# EAGLE design AC2 (EAGLE 6.4)

## Sheet 1 of 2
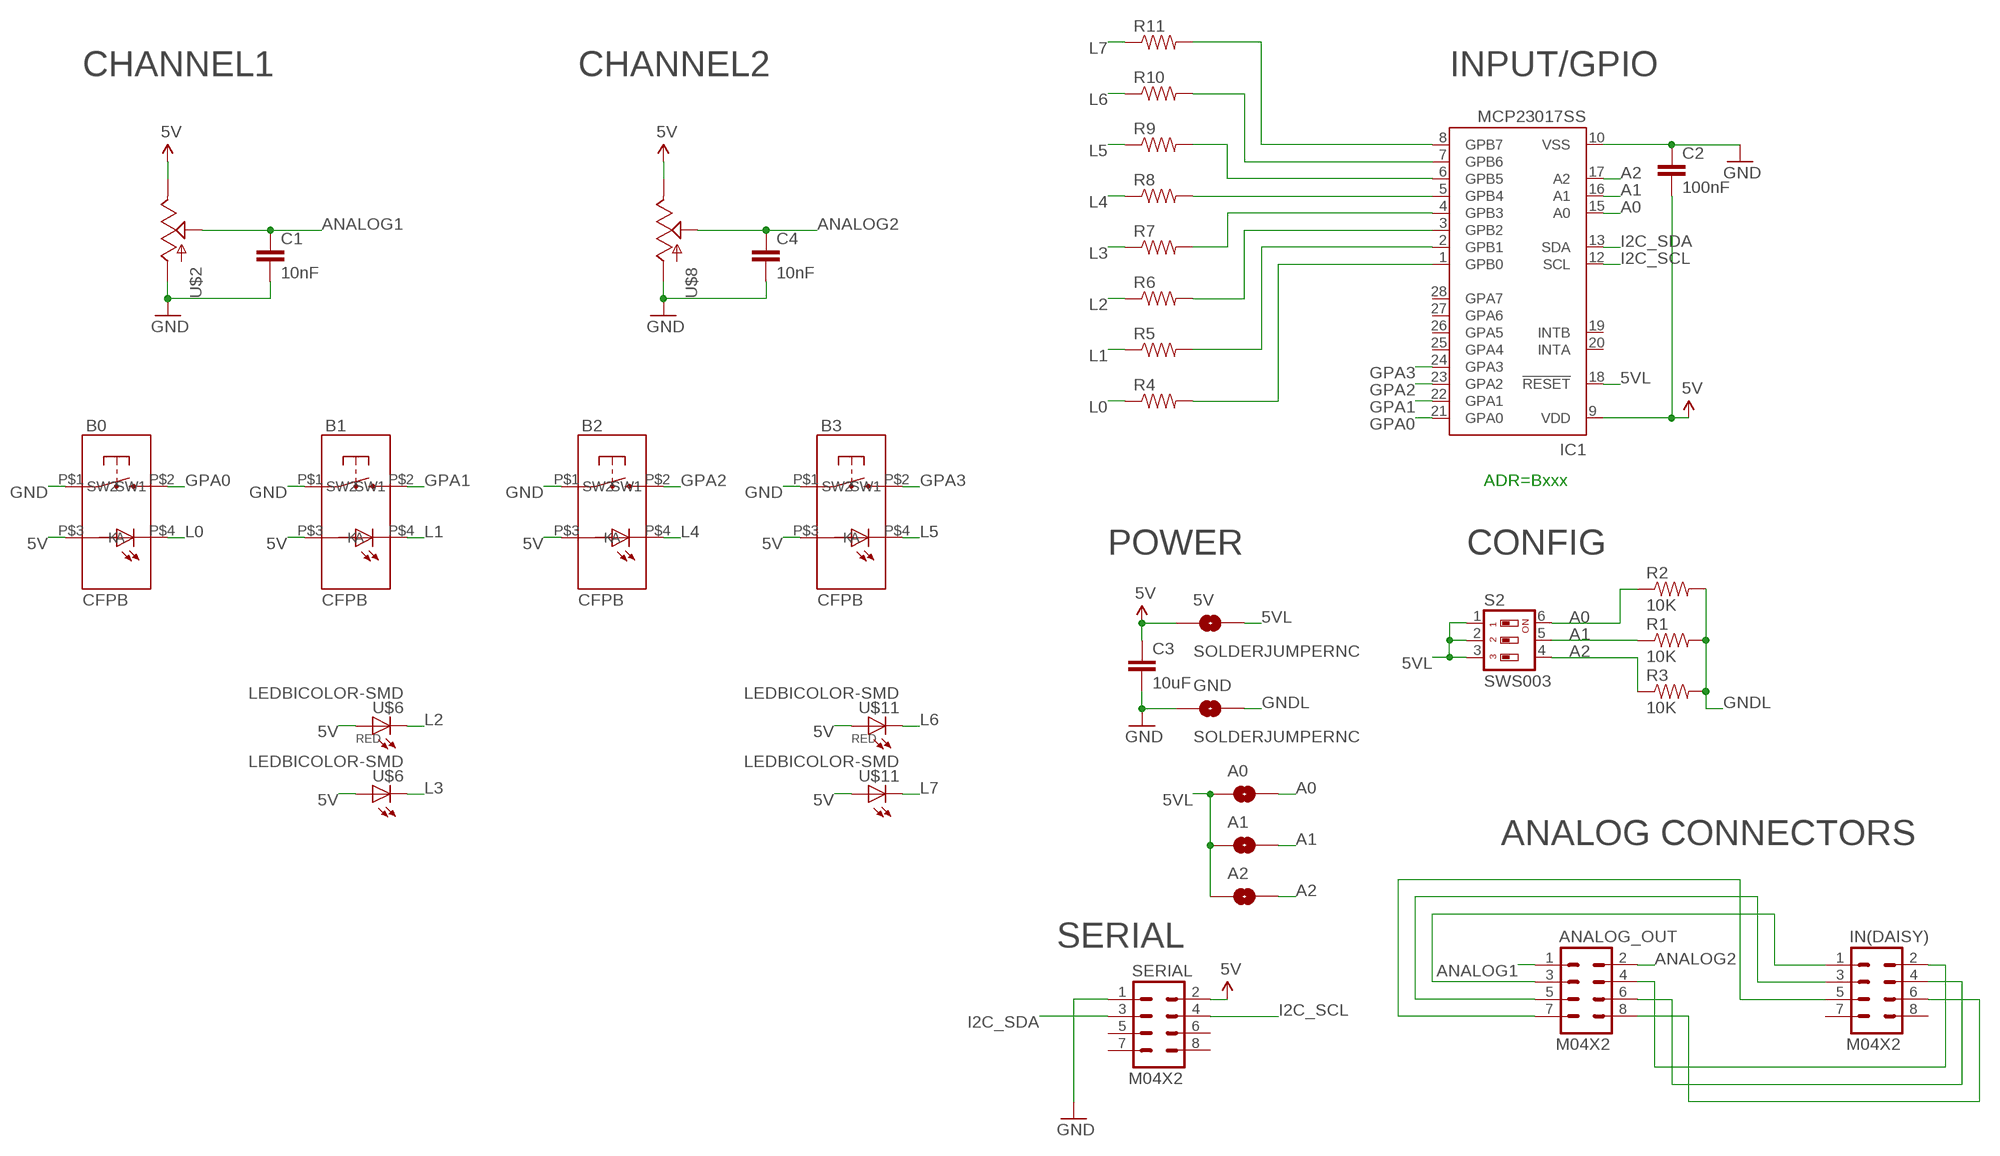
[diagram p0: schematic, sheet 1]

### Parts
5V  SOLDERJUMPERNC  [SJ_2S]
A0  SOLDERJUMPERNC  [SJ_2S]
A1  SOLDERJUMPERNC  [SJ_2S]
A2  SOLDERJUMPERNC  [SJ_2S]
ANALOG_OUT  M04X2  [2X4]
B0  CFPB  [CFPB-6/9MM]
B1  CFPB  [CFPB-6/9MM]
B2  CFPB  [CFPB-6/9MM]
B3  CFPB  [CFPB-6/9MM]
C1  10nF  CAP0603-CAP  [0603-CAP]
C2  100nF  CAP0603-CAP  [0603-CAP]
C3  10uF  CAP0805  [0805]
C4  10nF  CAP0603-CAP  [0603-CAP]
GND  SOLDERJUMPERNC  [SJ_2S]
IC1  MCP23017SS  [SSOP28]
IN(DAISY)  M04X2  [2X4]
R1  10K  RESISTOR0603-RES  [0603-RES]
R2  10K  RESISTOR0603-RES  [0603-RES]
R3  10K  RESISTOR0603-RES  [0603-RES]
R4  RESISTOR0603-RES  [0603-RES]
R5  RESISTOR0603-RES  [0603-RES]
R6  RESISTOR0603-RES  [0603-RES]
R7  RESISTOR0603-RES  [0603-RES]
R8  RESISTOR0603-RES  [0603-RES]
R9  RESISTOR0603-RES  [0603-RES]
R10  RESISTOR0603-RES  [0603-RES]
R11  RESISTOR0603-RES  [0603-RES]
S2  SWS003  [SMS-003]
SERIAL  M04X2  [2X4]
U$2  POT  [ALPS_POT]
U$6  LEDBICOLOR-SMD  [LEDBICOLOR-SMD]
U$8  POT  [ALPS_POT]
U$11  LEDBICOLOR-SMD  [LEDBICOLOR-SMD]

### Nets
5V [Power]: 5V.1 B0.P$3(A) B1.P$3(A) B2.P$3(A) B3.P$3(A) C2.2 C3.1 IC1.9(VDD) SERIAL.2 U$2.P$1(E) U$6.P$1(A) U$6.P$3(A1) U$8.P$1(E) U$11.P$1(A) U$11.P$3(A1)
5VL: 5V.2 A0.1 A1.1 A2.1 IC1.18(!RESET) S2.1 S2.2 S2.3
A0: A0.2 IC1.15(A0) R2.1 S2.6
A1: A1.2 IC1.16(A1) R1.1 S2.5
A2: A2.2 IC1.17(A2) R3.1 S2.4
ANALOG1: ANALOG_OUT.1 C1.1 U$2.P$2(S)
ANALOG2: ANALOG_OUT.2 C4.1 U$8.P$2(S)
GND [Power]: B0.P$1(SW1) B1.P$1(SW1) B2.P$1(SW1) B3.P$1(SW1) C1.2 C2.1 C3.2 C4.2 GND.1 IC1.10(VSS) SERIAL.1 U$2.P$3(A) U$8.P$3(A)
GNDL: GND.2 R1.2 R2.2 R3.2
GPA0: B0.P$2(SW2) IC1.21(GPA0)
GPA1: B1.P$2(SW2) IC1.22(GPA1)
GPA2: B2.P$2(SW2) IC1.23(GPA2)
GPA3: B3.P$2(SW2) IC1.24(GPA3)
I2C_SCL: IC1.12(SCL) SERIAL.4
I2C_SDA: IC1.13(SDA) SERIAL.3
L0: B0.P$4(K) R4.1
L1: B1.P$4(K) R5.1
L2: R6.1 U$6.P$2(C)
L3: R7.1 U$6.P$4(C1)
L4: B2.P$4(K) R8.1
L5: B3.P$4(K) R9.1
L6: R10.1 U$11.P$2(C)
L7: R11.1 U$11.P$4(C1)
N$2: IC1.4(GPB3) R7.2
N$3: IC1.5(GPB4) R8.2
N$4: IC1.6(GPB5) R9.2
N$5: IC1.7(GPB6) R10.2
N$6: IC1.8(GPB7) R11.2
N$7: IC1.3(GPB2) R6.2
N$8: IC1.2(GPB1) R5.2
N$9: IC1.1(GPB0) R4.2
N$10: ANALOG_OUT.3 IN(DAISY).1
N$11: ANALOG_OUT.5 IN(DAISY).3
N$12: ANALOG_OUT.7 IN(DAISY).5
N$13: ANALOG_OUT.4 IN(DAISY).2
N$14: ANALOG_OUT.6 IN(DAISY).4
N$15: ANALOG_OUT.8 IN(DAISY).6
Unconnected: IC1.19(INTB) IC1.20(INTA) IC1.25(GPA4) IC1.26(GPA5) IC1.27(GPA6) IC1.28(GPA7) IN(DAISY).7 IN(DAISY).8 SERIAL.5 SERIAL.6 SERIAL.7 SERIAL.8

### Notes on the sheet
- CHANNEL1 | CHANNEL2 | INPUT/GPIO
- ADR=Bxxx
- POWER | CONFIG
- ANALOG CONNECTORS
- SERIAL

## Sheet 2 of 2

## Library data of the parts
5V A0 A1 A2 GND = SparkFun:SOLDERJUMPER: Solder Jumper Standard SMD solder jumper. Used to automate production. Two varients : Normally Open and Normally Closed are the same, but have different paste layers. NC will have a large amount of paste and should jumper during reflow.
ANALOG_OUT IN(DAISY) SERIAL = SparkFun:M04X2
B0 B1-B3 = SKAARHOJ:CFPB
C1-C4 = SparkFun:CAP: Capacitor Standard 0603 ceramic capacitor, and 0.1" leaded capacitor.
IC1 = microchip:MCP23017: http://ww1.microchip.com/downloads/en/DeviceDoc/21952a.pdf Source: http://ww1.microchip.com/downloads/en/DeviceDoc/21952a.pdf; MF: MICROCHIP; MPN: MCP23017-E/SS; OC_FARNELL: 1467674; OC_NEWARK: 31K2960
R1-R11 = SparkFun:RESISTOR: Resistor Basic schematic elements and footprints for 0603, 1206, and PTH resistors.
S2 = smd-special:SWS003: SMD Dip Switch 3 pol.
U$2 U$8 = SparkFun:POT
U$6 U$11 = SKAARHOJ:LEDBICOLOR-SMD

## Net classes
0 default: width 0.203 mm, drill 0.406 mm, clearance 0.203 mm
1 Power: width 0.406 mm, drill 0.61 mm, clearance 0.203 mm

## Board
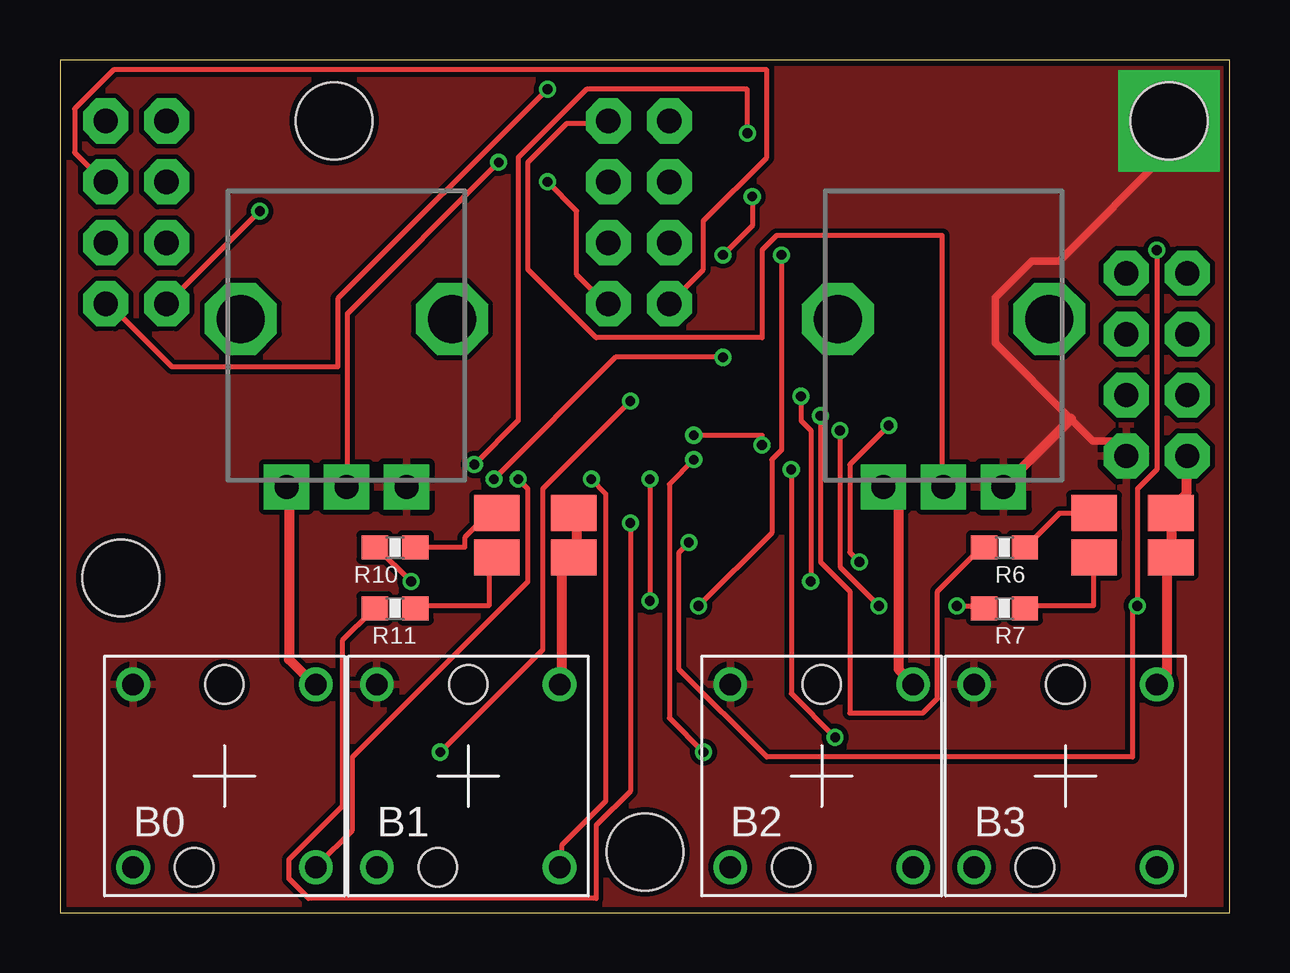
[diagram p1: board, top side]
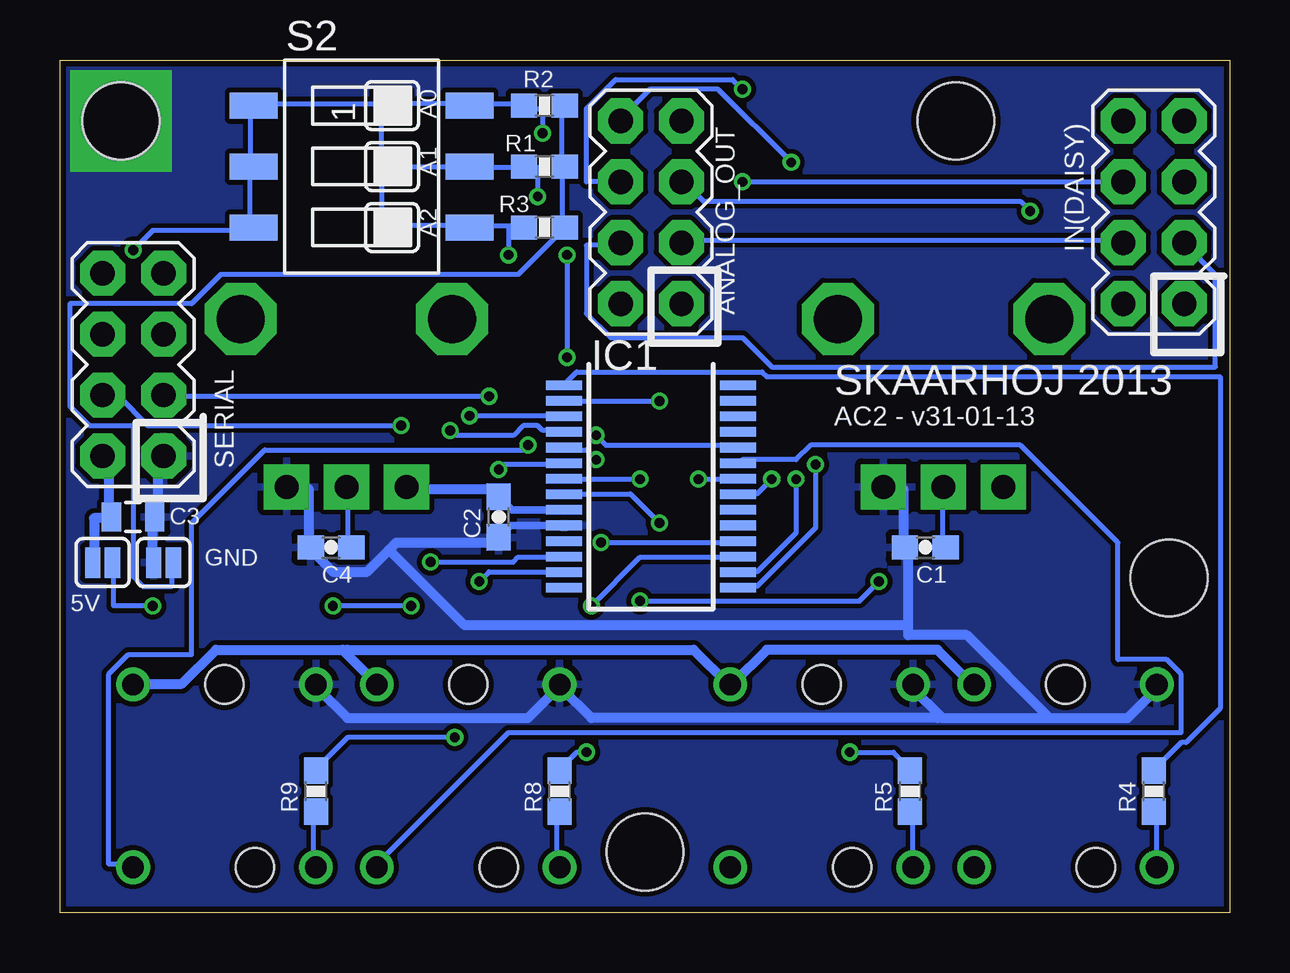
[diagram p2: board, bottom side, seen from below]

Size 48.77 x 35.56 mm. Coordinates in mm from the lower left corner, seen from the top.
Outline: 0,0 48.77,0 48.77,35.56 0,35.56 0,0
Copper layers (1*16): Top 0.035mm / dielectric 1.5mm / Bottom 0.035mm
Design rules "Fusion_eagle_rule_v1.1": minimum track width 6mil, minimum drill 12mil, track to track 6mil, track to pad 6mil, pad to pad 6mil, via to via 6mil, smd to smd 0mil, copper to edge 10mil, drill to drill 10mil, minimum pad ring 10mil, minimum via ring 6mil, stop-mask expansion 2mil, vias tented up to drill 100mil, thermal gap 10mil
Holes 3.2 mm at 24.38,2.54 46.23,33.02 11.43,33.02 2.54,13.97

### Footprints (pad centres in the part's own frame; a part is rotated, then mirrored left to right if it is on the bottom)
SJ_2S = smd 0.635 x 1.27: 1 -0.412,0; 2 0.412,0
2X4 = drill 1.016 pad 1.88 octagon: 1 -3.81,-1.27; 2 -3.81,1.27; 3 -1.27,-1.27; 4 -1.27,1.27; 5 1.27,-1.27; 6 1.27,1.27; 7 3.81,-1.27; 8 3.81,1.27
CFPB-6/9MM = drill 0.9: P$1 -3.81,3.81; P$2 3.81,-3.81; P$3 3.81,3.81; P$4 -3.81,-3.81 | hole 1.6: 0,3.81; -1.27,-3.81
0603-CAP = smd 1.1 x 1: 1 -0.85,0; 2 0.85,0
0805 = smd 0.8 x 1.2: 1 -0.9,0; 2 0.9,0
SSOP28 = smd 0.4 x 1.5: 1 -4.225,-3.625; 2 -3.575,-3.625; 3 -2.925,-3.625; 4 -2.275,-3.625; 5 -1.625,-3.625; 6 -0.975,-3.625; 7 -0.325,-3.625; 8 0.325,-3.625; 9 0.975,-3.625; 10 1.625,-3.625; 11 2.275,-3.625; 12 2.925,-3.625; 13 3.575,-3.625; 14 4.225,-3.625; 15 4.225,3.625; 16 3.575,3.625; 17 2.925,3.625; 18 2.275,3.625; 19 1.625,3.625; 20 0.975,3.625; 21 0.325,3.625; 22 -0.325,3.625; 23 -0.975,3.625; 24 -1.625,3.625; 25 -2.275,3.625; 26 -2.925,3.625; 27 -3.575,3.625; 28 -4.225,3.625
0603-RES = smd 1.1 x 1: 1 -0.85,0; 2 0.85,0
SMS-003 = smd 1.092 x 2.007: 1 -2.54,-4.496; 2 0,-4.496; 3 2.54,-4.496; 4 2.54,4.496; 5 0,4.496; 6 -2.54,4.496
ALPS_POT = drill 1 pad 1.88 square: P$1 7,-2.5; P$2 7,0; P$3 7,2.5 | drill 2 octagon: P$4 0,-4.4; P$5 0,4.4
LEDBICOLOR-SMD = smd 1.9 x 1.5: P$1 1.6,0.925; P$2 -1.6,0.925; P$3 1.6,-0.925; P$4 -1.6,-0.925

### Placement (x,y rotation side)
5V  46.99,14.61 0 bottom
A0  34.92,33.66 0 bottom
A1  34.92,31.11 0 bottom
A2  34.92,28.57 0 bottom
ANALOG_OUT  24.13,29.21 270 bottom
B0  6.86,5.71 0 top
B1  17.02,5.71 0 top
B2  31.75,5.71 0 top
B3  41.91,5.71 0 top
C1  12.7,15.24 180 bottom
C2  30.48,16.51 90 bottom
C3  45.72,16.51 0 bottom
C4  37.47,15.24 180 bottom
GND  44.45,14.61 0 bottom
IC1  24.13,17.78 270 bottom
IN(DAISY)  3.17,29.21 90 bottom
R1  28.57,31.11 0 bottom
R2  28.57,33.66 0 bottom
R3  28.57,28.57 0 bottom
R4  3.17,5.08 90 bottom
R5  13.34,5.08 90 bottom
R6  39.37,15.24 180 top
R7  39.37,12.7 180 top
R8  27.94,5.08 90 bottom
R9  38.1,5.08 90 bottom
R10  13.97,15.24 180 top
R11  13.97,12.7 180 top
S2  36.2,31.11 270 bottom
SERIAL  45.72,22.86 90 bottom
U$2  11.94,24.77 270 top
U$6  44.7,15.75 0 top
U$8  36.83,24.77 270 top
U$11  19.81,15.75 0 top

### Tracks (layer width: path | path; a pad name or v marks a point on that pad's centre or on a via)
5V
  Top 0.406: U$11.P$1 21.54,16.66 21.54,14.83 U$11.P$3 21.34,14.63 20.93,14.22 20.93,9.55 B1.P$3 | B0.P$3 10.57,9.55 9.55,10.57 9.55,17.68 U$2.P$1 | B2.P$3 35.56,9.55 34.95,10.16 34.95,17.07 34.34,17.68 U$8.P$1 | SERIAL.2 46.94,18.9 46.94,17.48 46.33,16.87 U$6.P$1 46.33,16.66 46.33,14.83 U$6.P$3 46.13,14.63 46.13,9.96 45.72,9.55 B3.P$3
  Bottom 0.305: IC1.9 29.93,16.8 C2.2
  Bottom 0.406: B0.P$3 10.77,9.55 12.19,10.97 19.3,10.97 20.73,9.55 B1.P$3 20.93,9.55 22.35,10.97 36.78,10.97 36.88,10.87 | C2.2 30.48,17.48 30.68,17.68 34.14,17.68 U$8.P$1 | SERIAL.2 46.94,18.9 46.74,18.9 46.74,16.66 C3.1 46.74,16.46 47.35,16.46 47.35,14.63 5V.1 | 36.88,10.87 36.98,10.97 42.27,10.97 43.69,9.55 45.72,9.55 B3.P$3 | 36.88,10.87 35.56,9.55 B2.P$3
5VL  (via drill 0.41)
  Top 0.203: v45.72,27.64 45.72,18.49 44.91,17.68 v44.91,12.8 44.7,12.6 44.7,6.5 29.46,6.5 25.81,10.16 25.81,15.04 v26.21,15.44
  Bottom 0.203: A2.1 35.36,28.65 35.36,31.09 A1.1 35.36,31.29 35.36,33.53 A0.1 35.36,33.73 40.64,33.73 S2.1 40.84,33.53 40.84,31.29 S2.2 40.84,31.09 40.84,28.65 S2.3 40.84,28.45 44.91,28.45 v45.72,27.64 | v44.91,12.8 46.53,12.8 46.53,14.43 5V.2 | v26.21,15.44 20.52,15.44 IC1.18
A0  (via drill 0.41)
  Top 0.203: v17.27,18.69 19.1,20.52 19.1,31.5 21.95,34.34 28.65,34.34 v28.65,32.51
  Bottom 0.203: 31.7,33.73 29.46,33.73 R2.1 29.26,33.53 28.65,33.53 v28.65,32.51 | 31.7,33.73 34.34,33.73 A0.2 | 31.7,33.73 S2.6 | v17.27,18.69 17.27,16.05 19.71,13.61 20.32,13.61 IC1.15
A1  (via drill 0.41)
  Top 0.203: v18.09,18.09 23.16,23.16 v27.64,23.16 | v27.64,27.43 28.85,28.65 v28.85,29.87
  Bottom 0.203: 31.7,31.09 29.46,31.09 R1.1 29.26,31.09 28.85,31.09 v28.85,29.87 | 31.7,31.09 34.34,31.09 A1.2 | 31.7,31.09 S2.5 | v18.09,18.09 18.09,15.85 19.71,14.22 20.32,14.22 IC1.16 | v27.64,27.43 v27.64,23.16
A2  (via drill 0.41)
  Top 0.203: v26.62,12.8 29.67,15.85 29.67,18.9 30.07,19.3 v30.07,27.43
  Bottom 0.203: 31.7,28.65 30.07,28.65 | 30.07,28.65 29.46,28.65 R3.1 | 31.7,28.65 34.34,28.65 A2.2 | 31.7,28.65 S2.4 | v26.62,12.8 24.59,14.83 20.52,14.83 IC1.17 | 30.07,28.65 v30.07,27.43
ANALOG1  (via drill 0.41)
  Top 0.203: v18.29,31.29 11.99,24.99 11.99,17.88 U$2.P$2
  Bottom 0.203: C1.1 11.99,15.24 11.99,17.68 U$2.P$2 | v18.29,31.29 21.34,34.34 24.18,34.34 25.4,33.12 ANALOG_OUT.1
ANALOG2
  Top 0.203: ANALOG_OUT.2 22.76,32.92 21.13,32.92 19.51,31.29 19.51,26.82 22.35,23.98 29.26,23.98 29.26,27.64 29.87,28.25 36.78,28.25 36.78,17.88 U$8.P$2
  Bottom 0.203: C4.1 36.78,15.24 36.78,17.68 U$8.P$2
GND  (via drill 3.2)
  Top 0.305: v46.23,33.02 46.23,31.75 41.66,27.18 40.51,27.18 38.99,25.65 38.99,23.75 42.14,20.6 43.05,19.68 43.81,19.68 SERIAL.1
  Top 0.406: 42.14,20.6 39.42,17.88 U$8.P$3
  Bottom 0.305: IC1.10 29.98,16.16 C2.1
  Bottom 0.406: GND.1 44.91,14.63 44.91,16.46 C3.2 44.7,16.66 44.7,18.9 44.5,18.9 SERIAL.1 | 38.41,15.24 38.41,17.68 39.22,17.68 U$8.P$3 | 35.05,15.14 35.97,14.22 37.39,14.22 38.41,15.24 | 35.05,15.14 34.75,15.44 30.68,15.44 30.48,15.65 C2.1 | 38.41,15.24 C4.2 | B3.P$1 38,9.35 36.78,8.13 29.26,8.13 28.04,9.35 B2.P$1 27.84,9.35 26.62,8.13 12.19,8.13 12.09,8.23 | U$2.P$3 14.43,17.68 13.61,17.68 13.61,15.24 C1.2 13.41,15.24 13.41,11.99 | 7.52,8.13 11.99,8.13 12.09,8.23 | 7.52,8.13 4.27,8.13 3.05,9.35 B0.P$1 | 12.09,8.23 13.21,9.35 B1.P$1 | 13.41,11.99 13.41,11.58 10.97,11.58 7.52,8.13 | 35.05,15.14 31.9,11.99 13.41,11.99
  pour Top: 0,0 49.53,0 49.53,35.56 0,35.56
  pour Bottom: 0,0 49.53,0 49.53,35.56 0,35.56
GNDL
  Bottom 0.203: R2.2 27.84,33.53 27.84,31.29 R1.2 27.84,31.09 27.84,28.65 R3.2 27.84,28.45 29.67,26.62 42.06,26.62 43.28,25.4 48.36,25.4 48.36,21.13 47.55,20.32 45.72,20.32 45.72,14.02 45.31,13.61 44.09,13.61 44.09,14.43 GND.2
GPA0  (via drill 0.41)
  Top 0.203: v19.1,18.09 19.51,17.68 19.51,13.82 12.19,6.5 12.19,3.45 10.77,2.03 B0.P$2
  Bottom 0.203: v19.1,18.09 19.71,17.48 20.32,17.48 IC1.21
GPA1  (via drill 0.41)
  Top 0.203: v22.15,18.09 22.76,17.48 22.76,4.67 20.93,2.85 20.93,2.03 B1.P$2
  Bottom 0.203: v22.15,18.09 20.52,18.09 IC1.22
GPA2
  Bottom 0.203: IC1.23 20.32,18.9 18.09,18.9 17.48,19.51 8.74,19.51 4.67,15.44 4.67,10.57 2.64,10.57 2.03,9.96 2.03,7.52 30.07,7.52 35.56,2.03 B2.P$2
GPA3  (via drill 0.41)
  Top 0.203: v26.42,19.91 29.26,19.91 v29.26,19.51
  Bottom 0.203: v26.42,19.91 26.01,19.51 20.52,19.51 IC1.24 | v29.26,19.51 29.46,19.3 40.23,19.3 43.28,16.26 43.28,10.77 45.92,10.77 46.74,9.96 46.74,2.03 45.72,2.03 B3.P$2
I2C_SCL  (via drill 0.41)
  Top 0.203: v33.33,14.63 32.92,15.04 32.92,18.69 v34.54,20.32
  Bottom 0.203: v33.33,14.63 29.87,14.63 29.67,14.83 27.84,14.83 IC1.12 | v34.54,20.32 45.11,20.32 46.33,21.54 46.94,21.54 SERIAL.4
I2C_SDA  (via drill 0.41)
  Top 0.203: v31.29,13.82 31.29,20.12 30.89,20.52 v30.89,21.54
  Bottom 0.203: v31.29,13.82 30.89,14.22 27.84,14.22 IC1.13 | v30.89,21.54 44.3,21.54 SERIAL.3
L0
  Bottom 0.203: B0.P$4 3.05,4.06 R4.1
L1
  Bottom 0.203: B1.P$4 13.21,4.06 R5.1
L2
  Top 0.203: R6.1 40.23,15.24 41.66,16.66 43.08,16.66 U$6.P$2
L3
  Top 0.203: R7.1 40.23,12.8 43.08,12.8 43.08,14.63 U$6.P$4
L4
  Bottom 0.203: R8.1 28.04,4.06 28.04,2.03 B2.P$4
L5
  Bottom 0.203: R9.1 38.2,4.06 38.2,2.03 B3.P$4
L6
  Top 0.203: R10.1 16.87,15.24 16.87,15.65 18.09,16.87 U$11.P$2
L7
  Top 0.203: R11.1 14.83,12.8 17.88,12.8 17.88,14.43 18.09,14.63 U$11.P$4
N$2  (via drill 0.41)
  Top 0.203: v37.39,12.8 38.41,12.8 R7.2 | v34.14,12.8 32.51,14.43 v32.51,20.12
  Bottom 0.203: v34.14,12.8 v37.39,12.8 | v32.51,20.12 32.31,19.91 29.87,19.91 29.46,20.32 28.85,20.32 28.65,20.12 27.84,20.12 IC1.4
N$3  (via drill 0.41)
  Top 0.203: v26.82,6.71 25.4,8.13 25.4,17.88 v26.42,18.9
  Bottom 0.203: v26.82,6.71 27.23,6.71 27.84,6.1 R8.2 | v26.42,18.9 26.82,19.3 27.64,19.3 IC1.5
N$4  (via drill 0.41)
  Top 0.203: v32.31,7.32 30.48,9.14 v30.48,18.49
  Bottom 0.203: v32.31,7.32 36.78,7.32 38,6.1 R9.2 | v30.48,18.49 30.28,18.69 27.84,18.69 IC1.6
N$5  (via drill 0.41)
  Top 0.203: v14.63,13.82 13.21,15.24 R10.2 | v24.59,18.09 v24.59,13.01
  Bottom 0.203: v14.63,13.82 15.44,13.01 v24.59,13.01 | v24.59,18.09 27.64,18.09 IC1.7
N$6  (via drill 0.41)
  Top 0.203: v23.77,16.26 23.77,5.08 22.35,3.66 22.35,0.61 10.36,0.61 9.55,1.42 9.55,2.23 11.79,4.47 11.79,11.38 13.01,12.6 R11.2
  Bottom 0.203: v23.77,16.26 24.99,17.48 27.64,17.48 IC1.8
N$7  (via drill 0.41)
  Top 0.203: v31.7,20.73 31.7,14.63 32.92,13.41 32.92,8.33 35.97,8.33 36.58,8.94 36.58,13.41 38.41,15.24 R6.2
  Bottom 0.203: v31.7,20.73 27.84,20.73 IC1.3
N$8  (via drill 0.41)
  Top 0.203: v15.85,6.71 20.12,10.97 20.12,17.68 v23.77,21.34
  Bottom 0.203: v15.85,6.71 14.02,6.71 13.41,6.1 R5.2 | v23.77,21.34 27.64,21.34 IC1.2
N$9
  Bottom 0.203: R4.2 3.05,6.1 2.03,7.11 1.83,7.11 0.41,8.53 0.41,22.35 19.3,22.35 19.51,22.55 27.23,22.55 27.64,22.15 IC1.1
N$10  (via drill 0.41)
  Top 0.203: v20.32,34.34 11.58,25.6 11.58,22.76 4.67,22.76 2.03,25.4 IN(DAISY).1
  Bottom 0.203: v20.32,34.34 20.73,34.75 25.6,34.75 26.82,33.53 26.82,30.48 ANALOG_OUT.3
N$11
  Bottom 0.203: IN(DAISY).3 1.83,27.84 0.61,26.62 0.61,22.76 19.1,22.76 20.32,23.98 25.81,23.98 26.82,24.99 26.82,27.84 25.4,27.84 ANALOG_OUT.5
N$12
  Top 0.203: ANALOG_OUT.7 26.82,26.82 26.82,28.85 29.46,31.5 29.46,35.15 2.23,35.15 0.61,33.53 0.61,31.7 1.83,30.48 IN(DAISY).5
N$13  (via drill 0.41)
  Top 0.203: v8.33,29.26 4.47,25.4 IN(DAISY).2
  Bottom 0.203: v8.33,29.26 8.74,29.67 21.95,29.67 22.76,30.48 ANALOG_OUT.4
N$14
  Bottom 0.203: IN(DAISY).4 4.47,28.04 22.76,28.04 ANALOG_OUT.6
N$15  (via drill 0.41)
  Top 0.203: v20.32,30.48 21.54,29.26 21.54,26.62 22.76,25.4 ANALOG_OUT.8
  Bottom 0.203: v20.32,30.48 IN(DAISY).6

### Text on the board
_bsilk: SKAARHOJ 2013 | AC2 - v31-01-13